# Altium schematic sheet PowerMonitor.SchDoc
size A4
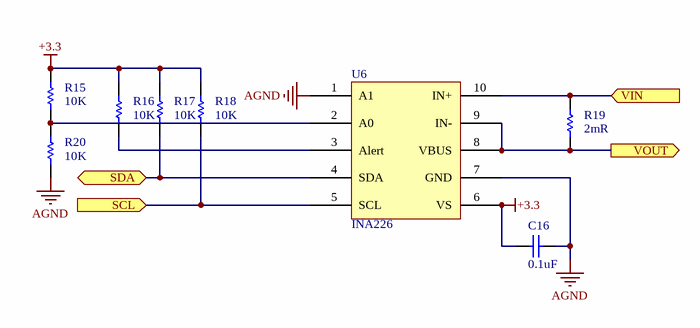
[diagram p0: PowerMonitor.SchDoc]

## Parts
C16  value 0.1uF  [C 0603_L]  (hidden comment: Cap)
R15  value 10K  [R 0603_L]  (hidden comment: Res1)
R16  value 10K  [R 0603_L]  (hidden comment: Res1)
R17  value 10K  [R 0603_L]  (hidden comment: Res1)
R18  value 10K  [R 0603_L]  (hidden comment: Res1)
R19  value 2mR  [R 2512_L]  (hidden comment: Res1)
R20  value 10K  [R 0603_L]  (hidden comment: Res1)
U6  INA226  [MSOP10_N]

## Ports
SCL (in), SDA (bidir), VIN (in), VOUT (out)

## Nets
+3.3: C16.1 R15.2 R16.2 R17.2 R18.2 U6.6(VS)
AGND: C16.2 R20.1 U6.1(A1) U6.7(GND)
SCL: R18.1 U6.5(SCL) ; port SCL
SDA: R17.1 U6.4(SDA) ; port SDA
VIN: R19.2 U6.10(IN+) ; port VIN
VOUT: R19.1 U6.8(VBUS) U6.9(IN-) ; port VOUT
NetR15_1: R15.1 R20.2 U6.2(A0)
NetR16_1: R16.1 U6.3(Alert)

## Library data of the parts
C16 = Cap: X5R 50V; Published: 8-Jun-2000; LatestRevisionDate: 17-Jul-2002; LatestRevisionNote: Re-released for DXP Platform.; PackageReference: RAD-0.3; Publisher: Altium Limited; PackageDescription: Radial Cap, Thru-Hole; 2 Leads; 0.3 in Pin Spacing
R15-R20 = Res1: Resistor; Published: 8-Jun-2000; LatestRevisionDate: 17-Jul-2002; LatestRevisionNote: Re-released for DXP Platform.; PackageReference: AXIAL-0.3; Publisher: Altium Limited; PackageDescription: Axial Device, Thru-Hole; 2 Leads; 0.3 in Pin Spacing